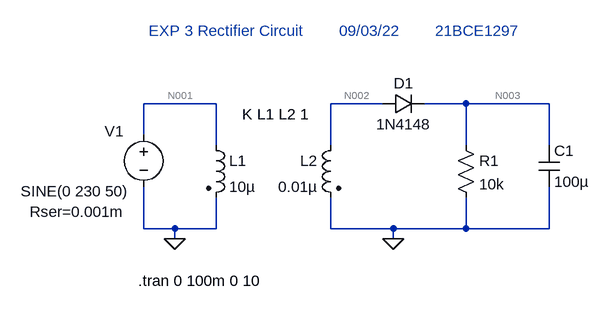
[diagram p0: schematic Exp3_Part2.asc]
Exp3_Part2.asc, the LTspice schematic file:
Version 4
SHEET 1 880 680
WIRE -656 176 -768 176
WIRE -400 176 -480 176
WIRE -272 176 -336 176
WIRE -144 176 -272 176
WIRE -768 224 -768 176
WIRE -656 240 -656 176
WIRE -480 240 -480 176
WIRE -272 240 -272 176
WIRE -144 240 -144 176
WIRE -768 368 -768 304
WIRE -720 368 -768 368
WIRE -656 368 -656 320
WIRE -656 368 -720 368
WIRE -480 368 -480 320
WIRE -384 368 -480 368
WIRE -272 368 -272 320
WIRE -272 368 -384 368
WIRE -144 368 -144 304
WIRE -144 368 -272 368
WIRE -720 384 -720 368
WIRE -384 384 -384 368
FLAG -720 384 0
FLAG -384 384 0
SYMBOL voltage -768 208 R0
WINDOW 0 -60 10 Left 2
WINDOW 3 -189 103 Left 2
WINDOW 123 0 0 Left 0
WINDOW 39 -175 134 Left 2
SYMATTR InstName V1
SYMATTR Value SINE(0 230 50)
SYMATTR SpiceLine Rser=0.001m
SYMBOL ind2 -672 224 R0
SYMATTR InstName L1
SYMATTR Value 10µ
SYMATTR Type ind
SYMBOL ind2 -464 224 M0
SYMATTR InstName L2
SYMATTR Value 0.01µ
SYMATTR Type ind
SYMBOL diode -400 192 R270
WINDOW 0 32 32 VTop 2
WINDOW 3 0 32 VBottom 2
SYMATTR InstName D1
SYMATTR Value 1N4148
SYMBOL res -288 224 R0
SYMATTR InstName R1
SYMATTR Value 10k
SYMBOL cap -160 240 R0
SYMATTR InstName C1
SYMATTR Value 100µ
TEXT -760 64 Left 2 ;EXP 3 Rectifier Circuit        09/03/22        21BCE1297
TEXT -616 192 Left 2 !K L1 L2 1
TEXT -776 448 Left 2 !.tran 0 100m 0 10

The netlist it stands for:
* Exp3_Part2.asc
V1 N001 0 SINE(0 230 50) Rser=0.001m
L1 N001 0 10µ
L2 N002 0 0.01µ
D1 N002 N003 1N4148
R1 N003 0 10k
C1 N003 0 100µ
.model D D
.lib standard.dio
* EXP 3 Rectifier Circuit        09/03/22        21BCE1297
K L1 L2 1
.tran 0 100m 0 10
.backanno
.end

* Results of the author's LTspice run, read from the files saved beside the schematic
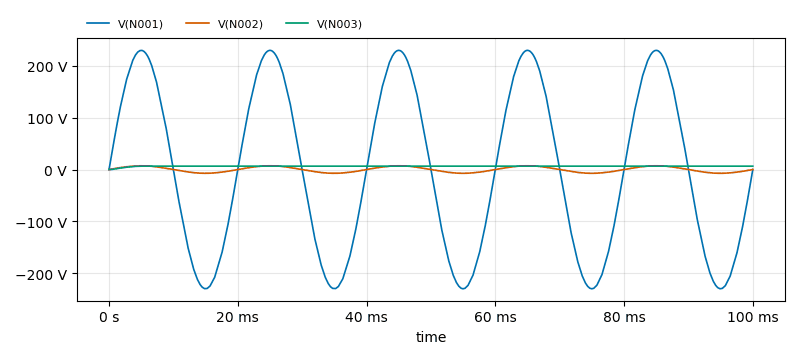
[diagram p1: Transient Analysis of Exp3_Part2.asc, plotted from the saved traces]
* Transient Analysis, 1 run:
*   V(N001): min -230.1 V, max 229.9 V, average -77.65 mV, rms 164.2 V, last 776.6 µV
*   V(N002): min -7.258 V, max 7.269 V, average -449.8 µV, rms 5.126 V, last 24.56 µV
*   V(N003): min 0 V, max 6.589 V, average 6.39 V, rms 6.439 V, last 6.495 V